# Altium project TITAN_ADAPTER.PrjPcb
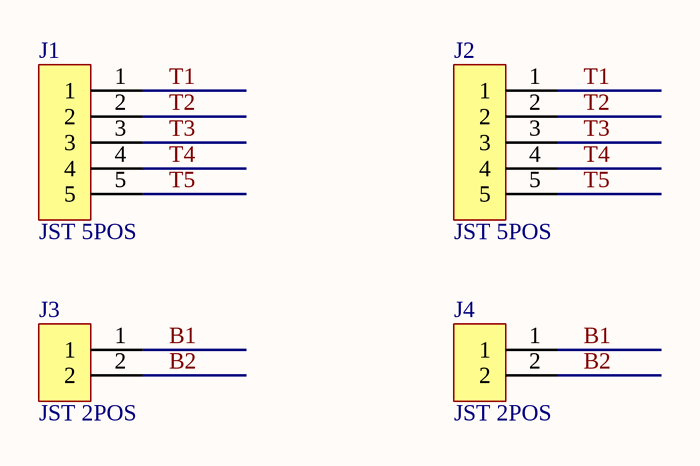
[diagram p0: TITAN_ADAPTER.SchDoc]
1 sheet, 4 parts. Net scope: global (net labels, ports and power ports of the same name join across sheets).
Board file: TITAN_ADAPTER.PcbDoc

## Sheet TITAN_ADAPTER.SchDoc
size A

### Parts
J1  JST 5POS  [JST-5]
J2  JST 5POS  [JST-5]
J3  JST 2POS  [JST-2]
J4  JST 2POS  [JST-2]

### Nets
B1: J3.1 J4.1
B2: J3.2 J4.2
T1: J1.1 J2.1
T2: J1.2 J2.2
T3: J1.3 J2.3
T4: J1.4 J2.4
T5: J1.5 J2.5

### Library data of the parts
J1 J2 = SM05B-SRSS-TB(LF)(SN): CONN HEADER SMD R/A 5POS 1MM, side mount; Connector Type: Male Pin; Number of Positions: 5; Current Rating: 1A; Voltage Rating: 50V; Contact Resistance: 40mR; Insulation Resistance: 100MR; Gender: Male; Supplier 1: Digi-Key; Supplier Part Number 1: 455-1805-1-ND; Manufacturer: JST; Manufacturer Part Number: SM05B-SRSS-TB(LF)(SN); RoHS: Yes; Category: Connectors; Stock 1: 368198; Pricing 1: 1=0.68000, 10=0.64200, 100=0.49200, 500=0.42782, 1000=0.35294 (USD); Mount: Surface Mount; Color: Natural; Contact Material: Copper Alloy; Contact Plating: Tin,Copper,Lead; Housing Material: Polyamide; Housing Color: Beige; Material: Polyamide; Min Operating Temperature: -25°C; Max Operating Temperature: 85°C; Number of Rows: 1; Packaging: Tape and Reel; Termination: Solder; Number of Contacts: 5; Max Current Rating: 1A; Voltage Rating (AC): 50V; Max Voltage Rating (AC): 50V; Max Voltage Rating (DC): 50V; Orientation: Right Angle; Length: 7mm; Pitch: 1mm; Lead Pitch: 1mm; Depth: 4.95mm; Lead Free: Lead Free; Flammability Rating: UL94 V-0; REACH SVHC: No SVHC; ComponentLink1URL: https://datasheet.ciiva.com/11752/0900766b8082f543-11752177.pdf?src-supplier=RSComponents; ComponentLink1Description: https://datasheet.ciiva.com/11752/0900766b8082f543-11752177.pdf?src-supplier=RSComponents; ComponentLink2URL: https://datasheet.ciiva.com/26894/getdatasheetpartid-473065-26894947.pdf?src-supplier=Verical; ComponentLink2Description: https://datasheet.ciiva.com/26894/getdatasheetpartid-473065-26894947.pdf?src-supplier=Verical; ComponentLink3URL: https://datasheet.ciiva.com/26938/getdatasheetpartid-744366-26938333.pdf?src-supplier=Verical; ComponentLink3Description: https://datasheet.ciiva.com/26938/getdatasheetpartid-744366-26938333.pdf?src-supplier=Verical; ComponentLink4URL: https://datasheet.ciiva.com/16217/sm05b-srss-tblfsn-16217550.pdf?src-supplier=Future+Electronics; ComponentLink4Description: https://datasheet.ciiva.com/16217/sm05b-srss-tblfsn-16217550.pdf?src-supplier=Future+Electronics; ComponentLink5URL: https://datasheet.ciiva.com/712/esr-712752.pdf?src-supplier=Digi-Key; ComponentLink5Description: https://datasheet.ciiva.com/712/esr-712752.pdf?src-supplier=Digi-Key; ComponentLink6URL: https://datasheet.ciiva.com/8052/esr-8052277.pdf?src-supplier=Element14; ComponentLink6Description: https://datasheet.ciiva.com/8052/esr-8052277.pdf?src-supplier=Element14; ComponentLink7URL: https://datasheet.ciiva.com/730/esr-730646.pdf?src-supplier=Digi-Key; ComponentLink7Description: https://datasheet.ciiva.com/730/esr-730646.pdf?src-supplier=Digi-Key; ComponentLink8URL: https://datasheet.ciiva.com/712/esr-712751.pdf?src-supplier=Digi-Key; ComponentLink8Description: https://datasheet.ciiva.com/712/esr-712751.pdf?src-supplier=Digi-Key
J3 J4 = SM02B-SRSS-TB(LF)(SN): Conn Shrouded Header HDR 2 POS 1mm Solder RA SMD T/R, side mount; Number of Contacts: 2; Connector Type: Header,Male Pin; Voltage Rating: 50V; Current Rating: 700mA; Insulation Resistance: 100MR; Contact Resistance: 40mR; Max Current Rating: 1A; Supplier 1: Newark; Supplier Part Number 1: 33P8179; Manufacturer: JST; Manufacturer Part Number: SM02B-SRSS-TB(LF)(SN); RoHS: Yes; Category: Connectors; Stock 1: 9138; Pricing 1: 1=0.41900, 10=0.39400, 25=0.33800, 50=0.29800, 100=0.29600, 250=0.27100, 500=0.25500, 1000=0.23500 (USD); Mount: Surface Mount; Contact Material: Copper Alloy,Copper; Housing Color: Beige; Housing Material: Polyamide; Color: Natural; Contact Plating: Tin,Copper,Lead; Material: Polyamide; Contact Shape: Square; Insulation Material: Nylon; Insulation Color: Natural; Min Operating Temperature: -25°C; Max Operating Temperature: 85°C; Orientation: Right Angle; Termination: Solder; Number of Rows: 1; Number of Positions: 2; Packaging: Tape and Reel; Max Voltage Rating (AC): 50V; Fastening Type: Push,Pull; Voltage Rating (AC): 50V; Length: 4mm; Pitch: 1mm; Depth: 4.95mm; Lead Pitch: 1mm; Lead Free: Lead Free; Flammability Rating: UL94 V-0; REACH SVHC: No SVHC; ComponentLink1URL: https://datasheet.ciiva.com/26924/getdatasheetpartid-640850-26924055.pdf?src-supplier=Verical; ComponentLink1Description: https://datasheet.ciiva.com/26924/getdatasheetpartid-640850-26924055.pdf?src-supplier=Verical; ComponentLink2URL: https://datasheet.ciiva.com/16391/sm02b-srss-tblfsn-16391308.pdf?src-supplier=Future+Electronics; ComponentLink2Description: https://datasheet.ciiva.com/16391/sm02b-srss-tblfsn-16391308.pdf?src-supplier=Future+Electronics; ComponentLink3URL: https://datasheet.ciiva.com/712/esr-712467.pdf?src-supplier=Digi-Key; ComponentLink3Description: https://datasheet.ciiva.com/712/esr-712467.pdf?src-supplier=Digi-Key; ComponentLink4URL: https://datasheet.ciiva.com/712/esr-712468.pdf?src-supplier=Digi-Key; ComponentLink4Description: https://datasheet.ciiva.com/712/esr-712468.pdf?src-supplier=Digi-Key; ComponentLink5URL: https://datasheet.ciiva.com/730/esr-730600.pdf?src-supplier=Digi-Key; ComponentLink5Description: https://datasheet.ciiva.com/730/esr-730600.pdf?src-supplier=Digi-Key; ComponentLink6URL: https://datasheet.ciiva.com/8052/91630-8052284.pdf?src-supplier=Element14; ComponentLink6Description: https://datasheet.ciiva.com/8052/91630-8052284.pdf?src-supplier=Element14